# EAGLE board OpticalBoardRev1 (EAGLE 8.2.1), part 1 of 2
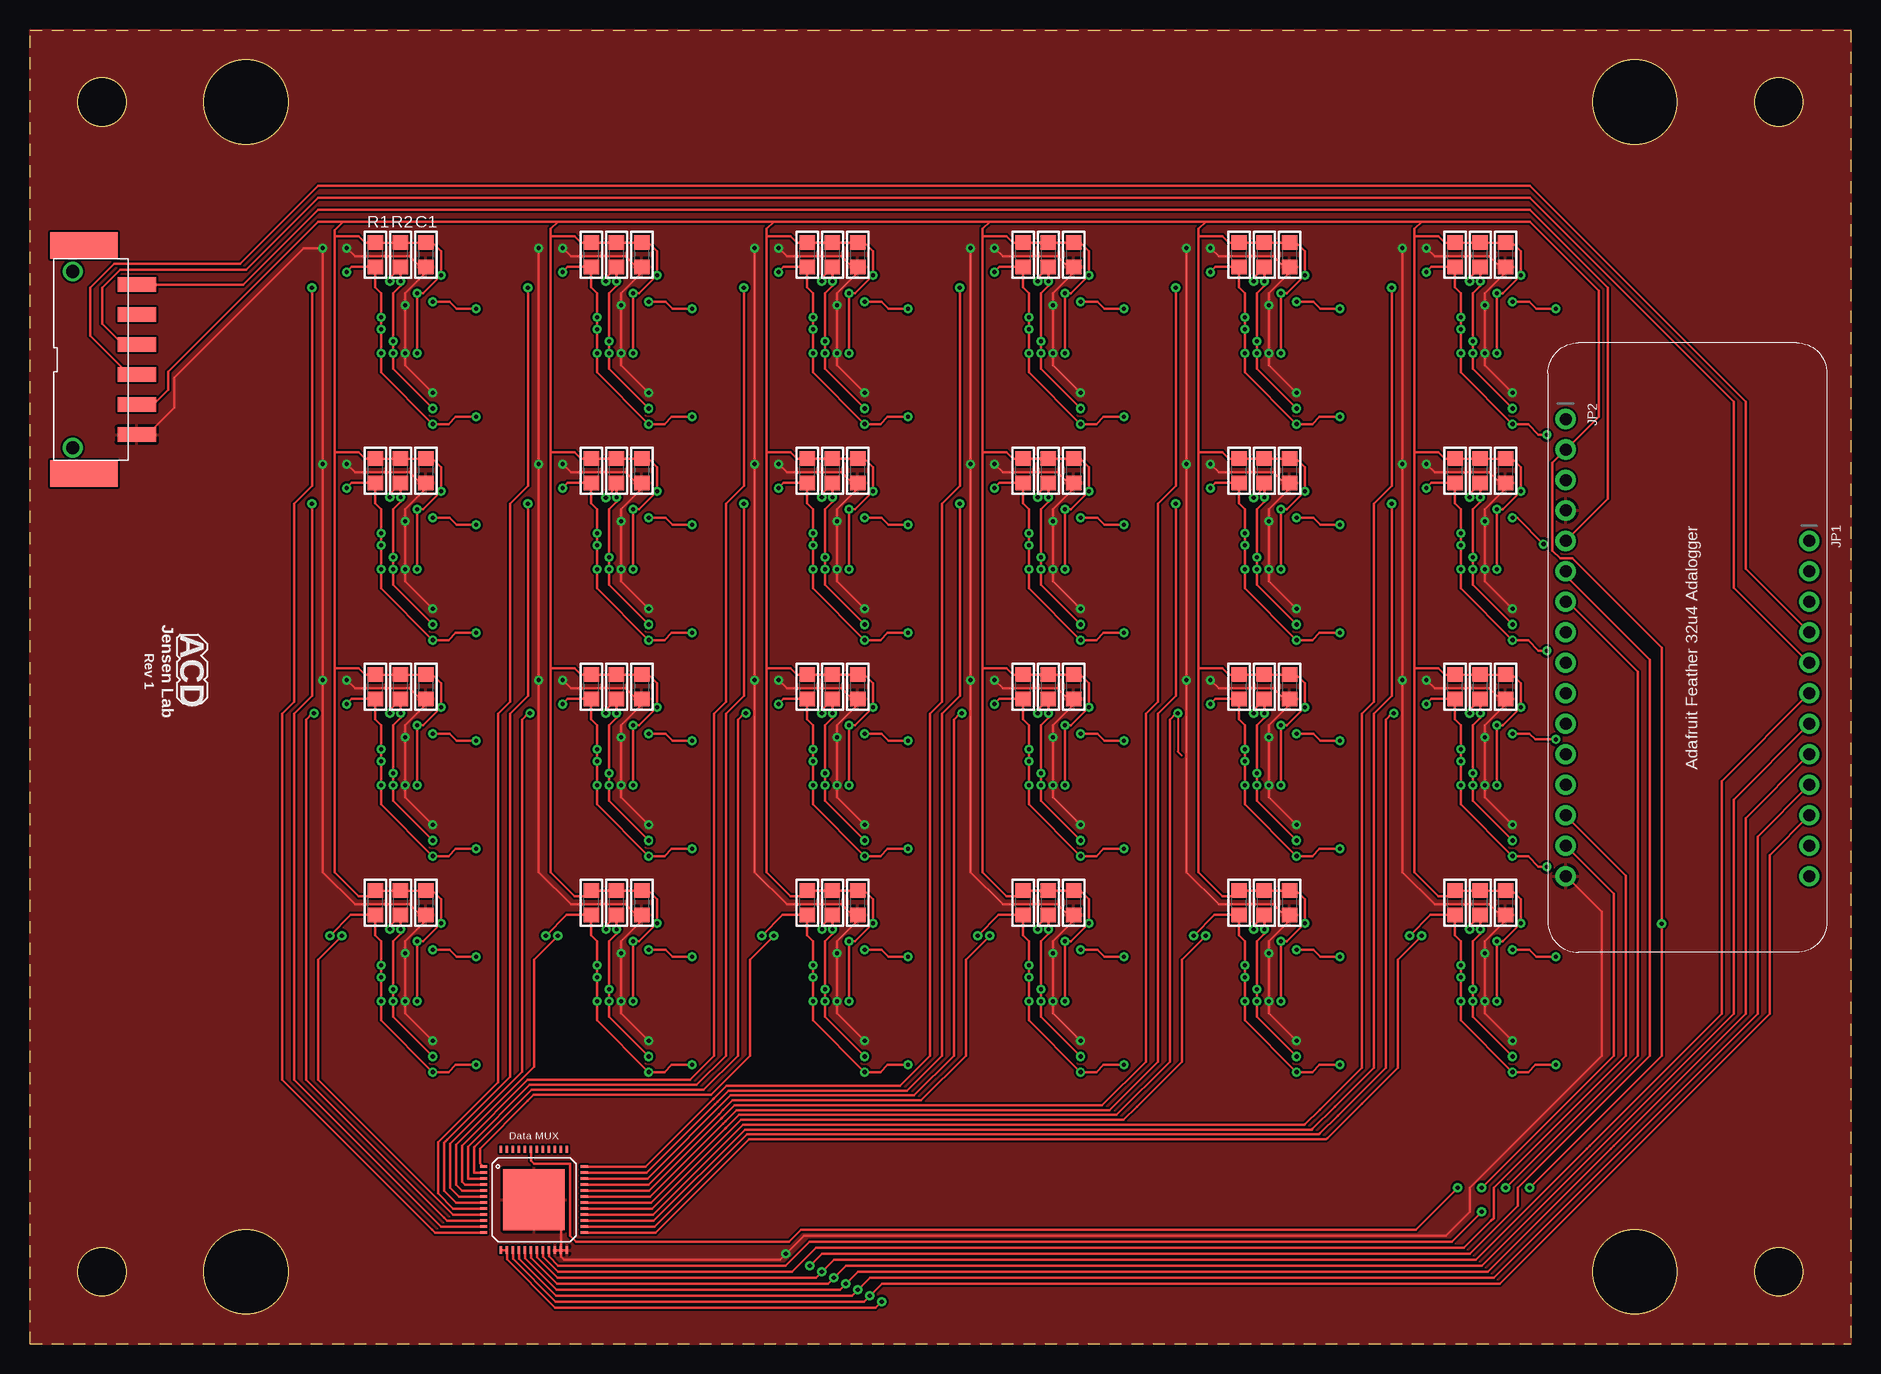
[diagram p2: board, top side]
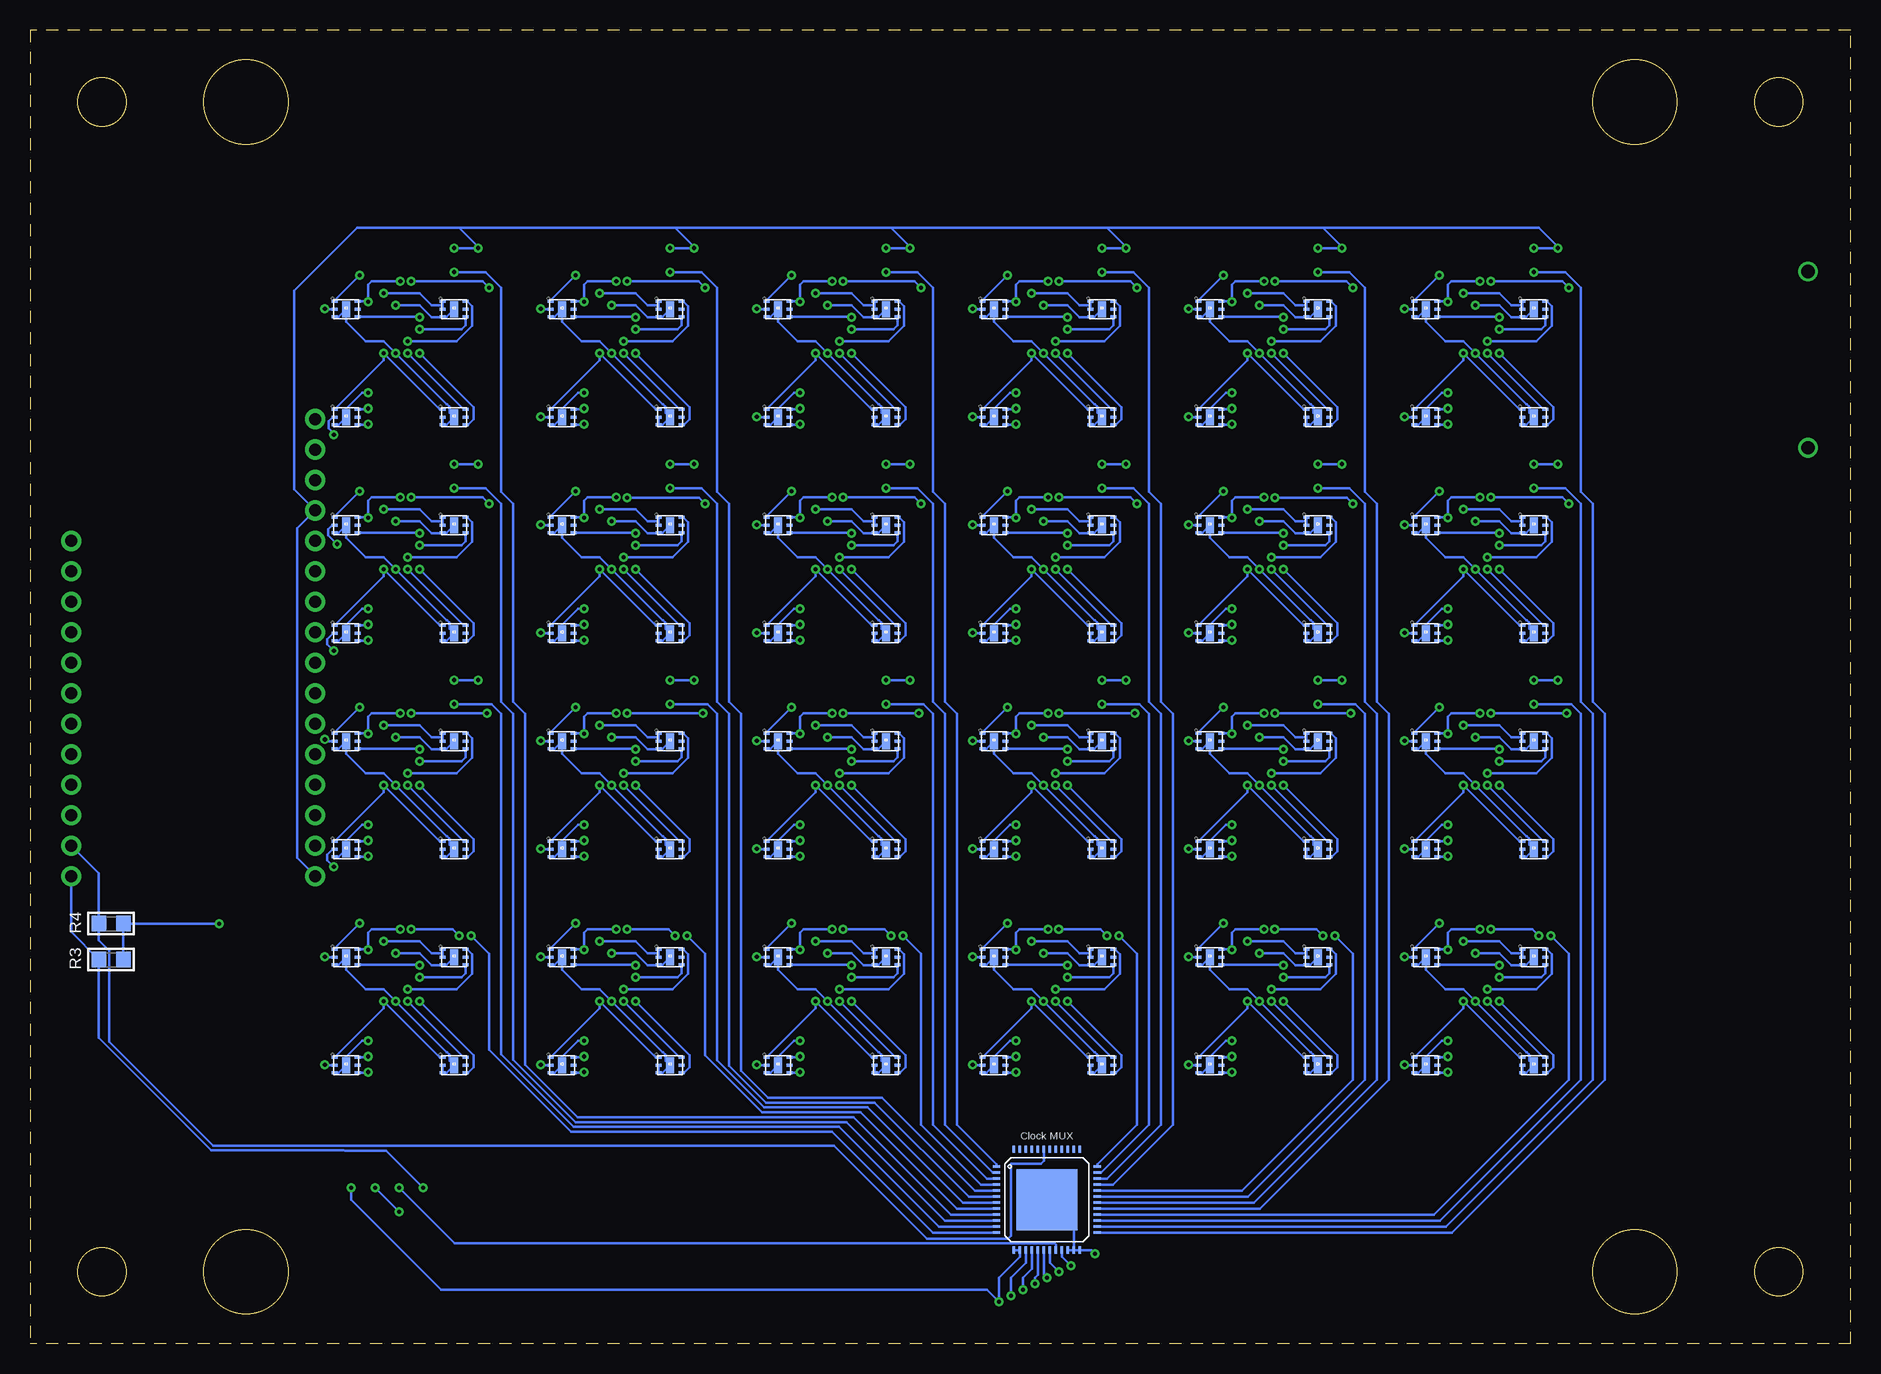
[diagram p3: board, bottom side, seen from below]

Size 151.76 x 109.47 mm. Coordinates in mm from the lower left corner, seen from the top.
Outline: 0,109.47 151.76,109.47 151.76,0 0,0 0,109.47
Outline: circle at 6,6 radius 2
Outline: circle at 145.76,6 radius 2
Outline: circle at 145.76,103.47 radius 2
Outline: circle at 6,103.47 radius 2
Outline: circle at 18,6 radius 3.5
Outline: circle at 18,103.47 radius 3.5
Outline: circle at 133.76,6 radius 3.5
Outline: circle at 133.76,103.47 radius 3.5
Copper layers (1*16): Top 0.035mm / dielectric 1.5mm / Bottom 0.035mm
Design rules "default *": minimum track width 6mil, minimum drill 0.35mm, track to track 7mil, track to pad 6mil, pad to pad 6mil, via to via 6mil, smd to smd 6mil, copper to edge 0mil, drill to drill 6mil, minimum pad ring 10mil, minimum via ring 8mil, stop-mask expansion 4mil, vias tented up to drill 0mil, thermal gap 10mil
Holes 4 mm at 6,6 145.76,6 6,103.47 145.76,103.47
Holes 7 mm at 18,103.47 133.76,103.47 18,6 133.76,6

## Footprints (pad centres in the part's own frame; a part is rotated, then mirrored left to right if it is on the bottom)
1X12_ROUND = drill 1 pad 1.676: 1 -13.97,0; 2 -11.43,0; 3 -8.89,0; 4 -6.35,0; 5 -3.81,0; 6 -1.27,0; 7 1.27,0; 8 3.81,0; 9 6.35,0; 10 8.89,0; 11 11.43,0; 12 13.97,0
1X16_ROUND = drill 1 pad 1.676: 1 -19.05,0; 2 -16.51,0; 3 -13.97,0; 4 -11.43,0; 5 -8.89,0; 6 -6.35,0; 7 -3.81,0; 8 -1.27,0; 9 1.27,0; 10 3.81,0; 11 6.35,0; 12 8.89,0; 13 11.43,0; 14 13.97,0; 15 16.51,0; 16 19.05,0
_0805 = smd 1.2 x 1.3: 1 -1.016,0; 2 1.016,0
2X2-OPT3002-2 = smd 0.5 x 0.25 bottom: 1 -0.95,0.56; 2 -0.95,-0.09; 3 -0.95,-0.74; 4 0.95,-0.74; 5 0.95,-0.09; 6 0.95,0.56; 8 -0.95,9.56; 9 -0.95,8.91; 10 -0.95,8.26; 11 0.95,8.26; 12 0.95,8.91; 13 0.95,9.56; 15 8.05,9.56; 16 8.05,8.91; 17 8.05,8.26; 18 9.95,8.26; 19 9.95,8.91; 20 9.95,9.56; 22 8.05,0.56; 23 8.05,-0.09; 24 8.05,-0.74; 25 9.95,-0.74; 26 9.95,-0.09; 27 9.95,0.56 | smd 0.65 x 1.35 bottom: 7 0,-0.09; 14 0,8.91; 21 9,8.91; 28 9,-0.09 | smd 1.3 x 1.2: 29 6.59,14.456; 30 6.59,12.424; 31 2.39,12.424; 32 2.39,14.456; 33 4.49,12.424; 34 4.49,14.456
CONNECTOR_6PIN = smd 1.2 x 3.2: 1 -6.25,4.4; 2 -3.75,4.4; 3 -1.25,4.4; 4 1.25,4.4; 5 3.75,4.4; 6 6.25,4.4 | drill 1.1: 7 -7.35,-0.95; 8 7.35,-0.95 | smd 2.2 x 5.6: LMOUNT -9.5,0; RMOUNT 9.5,0
32MUX = smd 0.6 x 0.22: 1 -4.2,2.75; 2 -4.2,2.25; 3 -4.2,1.75; 4 -4.2,1.25; 5 -4.2,0.75; 6 -4.2,0.25; 7 -4.2,-0.25; 8 -4.2,-0.75; 9 -4.2,-1.25; 10 -4.2,-1.75; 11 -4.2,-2.25; 12 -4.2,-2.75; 25 4.2,-2.75; 26 4.2,-2.25; 27 4.2,-1.75; 28 4.2,-1.25; 29 4.2,-0.75; 30 4.2,-0.25; 31 4.2,0.25; 32 4.2,0.75; 33 4.2,1.25; 34 4.2,1.75; 35 4.2,2.25; 36 4.2,2.75 | smd 0.22 x 0.6: 13 -2.75,-4.2; 14 -2.25,-4.2; 15 -1.75,-4.2; 16 -1.25,-4.2; 17 -0.75,-4.2; 18 -0.25,-4.2; 19 0.25,-4.2; 20 0.75,-4.2; 21 1.25,-4.2; 22 1.75,-4.2; 23 2.25,-4.2; 24 2.75,-4.2; 37 2.75,4.2; 38 2.25,4.2; 39 1.75,4.2; 40 1.25,4.2; 41 0.75,4.2; 42 0.25,4.2; 43 -0.25,4.2; 44 -0.75,4.2; 45 -1.25,4.2; 46 -1.75,4.2; 47 -2.25,4.2; 48 -2.75,4.2 | smd 5.1 x 5.1: 49 0,0
32MUX_BOT = smd 0.6 x 0.22 bottom: 1 4.2,2.75; 2 4.2,2.25; 3 4.2,1.75; 4 4.2,1.25; 5 4.2,0.75; 6 4.2,0.25; 7 4.2,-0.25; 8 4.2,-0.75; 9 4.2,-1.25; 10 4.2,-1.75; 11 4.2,-2.25; 12 4.2,-2.75; 25 -4.2,-2.75; 26 -4.2,-2.25; 27 -4.2,-1.75; 28 -4.2,-1.25; 29 -4.2,-0.75; 30 -4.2,-0.25; 31 -4.2,0.25; 32 -4.2,0.75; 33 -4.2,1.25; 34 -4.2,1.75; 35 -4.2,2.25; 36 -4.2,2.75 | smd 0.22 x 0.6 bottom: 13 2.75,-4.2; 14 2.25,-4.2; 15 1.75,-4.2; 16 1.25,-4.2; 17 0.75,-4.2; 18 0.25,-4.2; 19 -0.25,-4.2; 20 -0.75,-4.2; 21 -1.25,-4.2; 22 -1.75,-4.2; 23 -2.25,-4.2; 24 -2.75,-4.2; 37 -2.75,4.2; 38 -2.25,4.2; 39 -1.75,4.2; 40 -1.25,4.2; 41 -0.75,4.2; 42 -0.25,4.2; 43 0.25,4.2; 44 0.75,4.2; 45 1.25,4.2; 46 1.75,4.2; 47 2.25,4.2; 48 2.75,4.2 | smd 5.1 x 5.1 bottom: 49 0,0

## Placement (x,y rotation side)
JP1  [1X12_ROUND]  148.32,52.92 270 top
JP2  [1X16_ROUND]  128,58 270 top
R1  10K  [_0805]  145,35 0 bottom
R2  10K  [_0805]  145,32 0 bottom
U$1  2X2-OPT30022  [2X2-OPT3002-2]  26.4,23.3 0 top
U$2  2X2-OPT30022  [2X2-OPT3002-2]  26.4,41.3 0 top
U$3  2X2-OPT30022  [2X2-OPT3002-2]  26.4,59.3 0 top
U$4  2X2-OPT30022  [2X2-OPT3002-2]  26.4,77.3 0 top
U$5  2X2-OPT30022  [2X2-OPT3002-2]  44.4,23.3 0 top
U$6  2X2-OPT30022  [2X2-OPT3002-2]  44.4,41.3 0 top
U$7  2X2-OPT30022  [2X2-OPT3002-2]  44.4,59.3 0 top
U$8  2X2-OPT30022  [2X2-OPT3002-2]  44.4,77.3 0 top
U$9  2X2-OPT30022  [2X2-OPT3002-2]  62.4,23.3 0 top
U$10  2X2-OPT30022  [2X2-OPT3002-2]  62.4,41.3 0 top
U$11  2X2-OPT30022  [2X2-OPT3002-2]  62.4,59.3 0 top
U$12  2X2-OPT30022  [2X2-OPT3002-2]  62.4,77.3 0 top
U$13  2X2-OPT30022  [2X2-OPT3002-2]  80.4,23.3 0 top
U$14  2X2-OPT30022  [2X2-OPT3002-2]  80.4,41.3 0 top
U$15  2X2-OPT30022  [2X2-OPT3002-2]  80.4,59.3 0 top
U$16  2X2-OPT30022  [2X2-OPT3002-2]  80.4,77.3 0 top
U$17  2X2-OPT30022  [2X2-OPT3002-2]  98.4,23.3 0 top
U$18  2X2-OPT30022  [2X2-OPT3002-2]  98.4,41.3 0 top
U$19  2X2-OPT30022  [2X2-OPT3002-2]  98.4,59.3 0 top
U$20  2X2-OPT30022  [2X2-OPT3002-2]  98.4,77.3 0 top
U$21  2X2-OPT30022  [2X2-OPT3002-2]  116.4,23.3 0 top
U$22  2X2-OPT30022  [2X2-OPT3002-2]  116.4,41.3 0 top
U$23  2X2-OPT30022  [2X2-OPT3002-2]  116.4,59.3 0 top
U$24  2X2-OPT30022  [2X2-OPT3002-2]  116.4,77.3 0 top
U$25  CONNECTOR_6PIN  [CONNECTOR_6PIN]  4.5,82 270 top
U$26  32MUXTOP  [32MUX]  42,12 0 top
U$27  32MUXBOT  [32MUX_BOT]  67,12 0 top

## Tracks (layer width: path | path; a pad name or v marks a point on that pad's centre or on a via)
A0  (via drill 0.35)
  Top 0.203: U$26.15 40.25,7.06 43.81,3.5 69.5,3.5 v70,4 71,5 122.5,5 145,27.5 145,40.71 JP1.10
  Bottom 0.203: U$27.15 68.75,6.75 70,5.5 v70,4
A1  (via drill 0.35)
  Top 0.203: U$26.16 40.75,7.09 43.84,4 68.5,4 v69,4.5 70,5.5 122,5.5 144,27.5 144,42.25 JP1.9
  Bottom 0.203: U$27.16 68.25,6.25 69,5.5 v69,4.5
A2  (via drill 0.35)
  Top 0.203: U$26.17 41.25,7.13 43.88,4.5 67.5,4.5 v68,5 69,6 121.5,6 131.75,16.25 132,16.5 143,27.5 143,43.79 JP1.8
  Bottom 0.203: U$27.17 67.75,5.75 68,5.5 v68,5
A3  (via drill 0.35)
  Top 0.203: U$26.18 41.75,7.17 43.92,5 66.5,5 v67,5.5 68,6.5 121,6.5 142,27.5 142,45.33 JP1.7
  Bottom 0.203: U$27.18 67.25,5.75 v67,5.5
A4  (via drill 0.35)
  Top 0.203: U$26.19 42.25,7.21 43.96,5.5 65.5,5.5 v66,6 67,7 120.5,7 129.75,16.25 130,16.5 141,27.5 141,46.87 JP1.6
  Bottom 0.203: U$27.19 66.75,6.75 v66,6
CS1
  Top 0.203: U$26.20 42.75,7.25 44,6 63.5,6 65.5,8 119.54,8 121.77,10.23 122,10.46 122,13 133,24 133,39 128,44 JP2.14
CS2  (via drill 0.35)
  Top 0.203: JP2.15 132,37.5 132,24 v121,13
  Bottom 0.203: U$27.20 66.25,8.25 66.38,8.38 116.38,8.38 v121,13
GND  (via drill 0.35)
  Top 0.203: v33.58,25.23 31.28,27.53 v31.28,28.53 v31.28,32.53 31.28,33.53 32.99,35.24 U$1.30 32.53,35.72 31.66,36.6 27.1,36.6 24.4,39.3 v24.4,55.3 v24.4,73.3 v24.4,91.3 22.8,91.3 12,80.5 12,78 9.75,75.75 U$25.6 | v33.58,79.23 31.28,81.53 v31.28,82.53 v31.28,86.53 31.28,87.53 32.99,89.24 U$4.30 32.53,89.72 31.66,90.6 27.1,90.6 v26.4,91.3 | v33.58,61.23 31.28,63.53 v31.28,64.53 v31.28,68.53 31.28,69.53 32.99,71.24 U$3.30 32.53,71.72 31.66,72.6 27.1,72.6 v26.4,73.3 | v33.58,43.23 31.28,45.53 v31.28,46.53 v31.28,50.53 31.28,51.53 32.99,53.24 U$2.30 32.53,53.72 31.66,54.6 27.1,54.6 v26.4,55.3 | v51.58,25.23 49.28,27.53 v49.28,28.53 v49.28,32.53 49.28,33.53 50.99,35.24 U$5.30 50.53,35.72 49.66,36.6 45.1,36.6 42.4,39.3 v42.4,55.3 v42.4,73.3 v42.4,91.3 | v51.58,79.23 49.28,81.53 v49.28,82.53 v49.28,86.53 49.28,87.53 50.99,89.24 U$8.30 50.53,89.72 49.66,90.6 45.1,90.6 v44.4,91.3 | v51.58,61.23 49.28,63.53 v49.28,64.53 v49.28,68.53 49.28,69.53 50.99,71.24 U$7.30 50.53,71.72 49.66,72.6 45.1,72.6 v44.4,73.3 | v51.58,43.23 49.28,45.53 v49.28,46.53 v49.28,50.53 49.28,51.53 50.99,53.24 U$6.30 50.53,53.72 49.66,54.6 45.1,54.6 v44.4,55.3 | v69.58,25.23 67.28,27.53 v67.28,28.53 v67.28,32.53 67.28,33.53 68.99,35.24 U$9.30 68.53,35.72 67.66,36.6 63.1,36.6 60.4,39.3 v60.4,55.3 v60.4,73.3 v60.4,91.3 | v69.58,79.23 67.28,81.53 v67.28,82.53 v67.28,86.53 67.28,87.53 68.99,89.24 U$12.30 68.53,89.72 67.66,90.6 63.1,90.6 v62.4,91.3 | v69.58,61.23 67.28,63.53 v67.28,64.53 v67.28,68.53 67.28,69.53 68.99,71.24 U$11.30 68.53,71.72 67.66,72.6 63.1,72.6 v62.4,73.3
  Top 0.203: v69.58,43.23 67.28,45.53 v67.28,46.53 v67.28,50.53 67.28,51.53 68.99,53.24 U$10.30 68.53,53.72 67.66,54.6 63.1,54.6 v62.4,55.3 | v87.58,25.23 85.28,27.53 v85.28,28.53 v85.28,32.53 85.28,33.53 86.99,35.24 U$13.30 86.53,35.72 85.66,36.6 81.1,36.6 78.4,39.3 v78.4,55.3 v78.4,73.3 v78.4,91.3 | v87.58,79.23 85.28,81.53 v85.28,82.53 v85.28,86.53 85.28,87.53 86.99,89.24 U$16.30 86.53,89.72 85.66,90.6 81.1,90.6 v80.4,91.3 | v87.58,61.23 85.28,63.53 v85.28,64.53 v85.28,68.53 85.28,69.53 86.99,71.24 U$15.30 86.53,71.72 85.66,72.6 81.1,72.6 v80.4,73.3 | v87.58,43.23 85.28,45.53 v85.28,46.53 v85.28,50.53 85.28,51.53 86.99,53.24 U$14.30 86.53,53.72 85.66,54.6 81.1,54.6 v80.4,55.3 | v105.58,25.23 103.28,27.53 v103.28,28.53 v103.28,32.53 103.28,33.53 104.99,35.24 U$17.30 104.53,35.72 103.66,36.6 99.1,36.6 96.4,39.3 v96.4,55.3 v96.4,73.3 v96.4,91.3 | v105.58,79.23 103.28,81.53 v103.28,82.53 v103.28,86.53 103.28,87.53 104.99,89.24 U$20.30 104.53,89.72 103.66,90.6 99.1,90.6 v98.4,91.3 | v105.58,61.23 103.28,63.53 v103.28,64.53 v103.28,68.53 103.28,69.53 104.99,71.24 U$19.30 104.53,71.72 103.66,72.6 99.1,72.6 v98.4,73.3 | v105.58,43.23 103.28,45.53 v103.28,46.53 v103.28,50.53 103.28,51.53 104.99,53.24 U$18.30 104.53,53.72 103.66,54.6 99.1,54.6 v98.4,55.3 | v123.58,25.23 121.28,27.53 v121.28,28.53 v121.28,32.53 121.28,33.53 122.99,35.24 U$21.30 122.53,35.72 121.66,36.6 117.1,36.6 114.4,39.3 v114.4,55.3 v114.4,73.3 v114.4,91.3 | v123.58,79.23 121.28,81.53 v121.28,82.53 v121.28,86.53 121.28,87.53 122.99,89.24 U$24.30 122.53,89.72 121.66,90.6 117.1,90.6 v116.4,91.3
  Top 0.203: v123.58,61.23 121.28,63.53 v121.28,64.53 v121.28,68.53 121.28,69.53 122.99,71.24 U$23.30 122.53,71.72 121.66,72.6 117.1,72.6 v116.4,73.3 | v123.58,43.23 121.28,45.53 v121.28,46.53 v121.28,50.53 121.28,51.53 122.99,53.24 U$22.30 122.53,53.72 121.66,54.6 117.1,54.6 v116.4,55.3 | U$26.23 44.25,7.25 44.5,7 62.5,7 v63,7.5 64.5,9 118,9 120,11 120,13 131,24 131,36 128.05,38.95 JP2.16 | U$26.23 U$26.24 | U$26.23 U$26.22 | U$26.49 44.25,9.75 U$26.23
  Bottom 0.203: U$1.18 36.05,31.56 U$1.21 35.4,31.15 33.78,29.53 32.28,29.53 v31.28,28.53 27.01,24.26 26.98,24.26 26.82,24.1 26.82,24.07 26.78,24.03 26.78,23.59 U$1.7 27.05,22.56 U$1.4 U$1.5 | U$1.25 36.05,22.56 U$1.28 35.4,23.91 34.08,25.23 v33.58,25.23 | U$1.14 27.05,31.56 U$1.11 27.38,31.53 28.28,31.53 29.28,32.53 v31.28,32.53 | U$4.18 36.05,85.56 U$4.21 35.4,85.15 33.78,83.53 32.28,83.53 v31.28,82.53 27.01,78.26 26.98,78.26 26.82,78.1 26.82,78.07 26.78,78.03 26.78,77.59 U$4.7 27.05,76.56 U$4.4 U$4.5 | U$4.25 36.05,76.56 U$4.28 35.4,77.91 34.08,79.23 v33.58,79.23 | U$4.14 27.05,85.56 U$4.11 27.38,85.53 28.28,85.53 29.28,86.53 v31.28,86.53 | U$3.18 36.05,67.56 U$3.21 35.4,67.15 33.78,65.53 32.28,65.53 v31.28,64.53 27.01,60.26 26.98,60.26 26.82,60.1 26.82,60.07 26.78,60.03 26.78,59.59 U$3.7 27.05,58.56 U$3.4 U$3.5 | U$3.25 36.05,58.56 U$3.28 35.4,59.91 34.08,61.23 v33.58,61.23 | U$3.14 27.05,67.56 U$3.11 27.38,67.53 28.28,67.53 29.28,68.53 v31.28,68.53 | U$2.18 36.05,49.56 U$2.21 35.4,49.15 33.78,47.53 32.28,47.53 v31.28,46.53 27.01,42.26 26.98,42.26 26.82,42.1 26.82,42.07 26.78,42.03 26.78,41.59 U$2.7 27.05,40.56 U$2.4 U$2.5 | U$2.25 36.05,40.56 U$2.28 35.4,41.91 34.08,43.23 v33.58,43.23 | U$2.14 27.05,49.56 U$2.11 27.38,49.53 28.28,49.53 29.28,50.53 v31.28,50.53 | v26.4,55.3 v24.4,55.3 | v26.4,73.3 v24.4,73.3 | v26.4,91.3 v24.4,91.3 24.4,91.4 26,93 44,93 | U$5.18 54.05,31.56 U$5.21 53.4,31.15 51.78,29.53 50.28,29.53 v49.28,28.53 45.01,24.26 44.98,24.26 44.82,24.1 44.82,24.07 44.78,24.03 44.78,23.59 U$5.7 45.05,22.56 U$5.4 U$5.5 | U$5.25 54.05,22.56 U$5.28 53.4,23.91 52.08,25.23 v51.58,25.23
  Bottom 0.203: U$5.14 45.05,31.56 U$5.11 45.38,31.53 46.28,31.53 47.28,32.53 v49.28,32.53 | U$8.18 54.05,85.56 U$8.21 53.4,85.15 51.78,83.53 50.28,83.53 v49.28,82.53 45.01,78.26 44.98,78.26 44.82,78.1 44.82,78.07 44.78,78.03 44.78,77.59 U$8.7 45.05,76.56 U$8.4 U$8.5 | U$8.25 54.05,76.56 U$8.28 53.4,77.91 52.08,79.23 v51.58,79.23 | U$8.14 45.05,85.56 U$8.11 45.38,85.53 46.28,85.53 47.28,86.53 v49.28,86.53 | U$7.18 54.05,67.56 U$7.21 53.4,67.15 51.78,65.53 50.28,65.53 v49.28,64.53 45.01,60.26 44.98,60.26 44.82,60.1 44.82,60.07 44.78,60.03 44.78,59.59 U$7.7 45.05,58.56 U$7.4 U$7.5 | U$7.25 54.05,58.56 U$7.28 53.4,59.91 52.08,61.23 v51.58,61.23 | U$7.14 45.05,67.56 U$7.11 45.38,67.53 46.28,67.53 47.28,68.53 v49.28,68.53 | U$6.18 54.05,49.56 U$6.21 53.4,49.15 51.78,47.53 50.28,47.53 v49.28,46.53 45.01,42.26 44.98,42.26 44.82,42.1 44.82,42.07 44.78,42.03 44.78,41.59 U$6.7 45.05,40.56 U$6.4 U$6.5 | U$6.25 54.05,40.56 U$6.28 53.4,41.91 52.08,43.23 v51.58,43.23 | U$6.14 45.05,49.56 U$6.11 45.38,49.53 46.28,49.53 47.28,50.53 v49.28,50.53 | v44.4,55.3 v42.4,55.3 | v44.4,73.3 v42.4,73.3 | v44.4,91.3 v42.4,91.3 42.4,91.4 44,93 | U$9.18 72.05,31.56 U$9.21 71.4,31.15 69.78,29.53 68.28,29.53 v67.28,28.53 63.01,24.26 62.98,24.26 62.82,24.1 62.82,24.07 62.78,24.03 62.78,23.59 U$9.7 63.05,22.56 U$9.4 U$9.5 | U$9.25 72.05,22.56 U$9.28 71.4,23.91 70.08,25.23 v69.58,25.23 | U$9.14 63.05,31.56 U$9.11 63.38,31.53 64.28,31.53 65.28,32.53 v67.28,32.53 | U$12.18 72.05,85.56 U$12.21 71.4,85.15 69.78,83.53 68.28,83.53 v67.28,82.53 63.01,78.26 62.98,78.26 62.82,78.1 62.82,78.07 62.78,78.03 62.78,77.59 U$12.7 63.05,76.56 U$12.4 U$12.5
  Bottom 0.203: U$12.25 72.05,76.56 U$12.28 71.4,77.91 70.08,79.23 v69.58,79.23 | U$12.14 63.05,85.56 U$12.11 63.38,85.53 64.28,85.53 65.28,86.53 v67.28,86.53 | U$11.18 72.05,67.56 U$11.21 71.4,67.15 69.78,65.53 68.28,65.53 v67.28,64.53 63.01,60.26 62.98,60.26 62.82,60.1 62.82,60.07 62.78,60.03 62.78,59.59 U$11.7 63.05,58.56 U$11.4 U$11.5 | U$11.25 72.05,58.56 U$11.28 71.4,59.91 70.08,61.23 v69.58,61.23 | U$11.14 63.05,67.56 U$11.11 63.38,67.53 64.28,67.53 65.28,68.53 v67.28,68.53 | U$10.18 72.05,49.56 U$10.21 71.4,49.15 69.78,47.53 68.28,47.53 v67.28,46.53 63.01,42.26 62.98,42.26 62.82,42.1 62.82,42.07 62.78,42.03 62.78,41.59 U$10.7 63.05,40.56 U$10.4 U$10.5 | U$10.25 72.05,40.56 U$10.28 71.4,41.91 70.08,43.23 v69.58,43.23 | U$10.14 63.05,49.56 U$10.11 63.38,49.53 64.28,49.53 65.28,50.53 v67.28,50.53 | v62.4,55.3 v60.4,55.3 | v62.4,73.3 v60.4,73.3 | v62.4,91.3 v60.4,91.3 60.4,91.4 62,93 | U$13.18 90.05,31.56 U$13.21 89.4,31.15 87.78,29.53 86.28,29.53 v85.28,28.53 81.01,24.26 80.98,24.26 80.82,24.1 80.82,24.07 80.78,24.03 80.78,23.59 U$13.7 81.05,22.56 U$13.4 U$13.5 | U$13.25 90.05,22.56 U$13.28 89.4,23.91 88.08,25.23 v87.58,25.23 | U$13.14 81.05,31.56 U$13.11 81.38,31.53 82.28,31.53 83.28,32.53 v85.28,32.53 | U$16.18 90.05,85.56 U$16.21 89.4,85.15 87.78,83.53 86.28,83.53 v85.28,82.53 81.01,78.26 80.98,78.26 80.82,78.1 80.82,78.07 80.78,78.03 80.78,77.59 U$16.7 81.05,76.56 U$16.4 U$16.5 | U$16.25 90.05,76.56 U$16.28 89.4,77.91 88.08,79.23 v87.58,79.23 | U$16.14 81.05,85.56 U$16.11 81.38,85.53 82.28,85.53 83.28,86.53 v85.28,86.53 | U$15.18 90.05,67.56 U$15.21 89.4,67.15 87.78,65.53 86.28,65.53 v85.28,64.53 81.01,60.26 80.98,60.26 80.82,60.1 80.82,60.07 80.78,60.03 80.78,59.59 U$15.7 81.05,58.56 U$15.4 U$15.5
  Bottom 0.203: U$15.25 90.05,58.56 U$15.28 89.4,59.91 88.08,61.23 v87.58,61.23 | U$15.14 81.05,67.56 U$15.11 81.38,67.53 82.28,67.53 83.28,68.53 v85.28,68.53 | U$14.18 90.05,49.56 U$14.21 89.4,49.15 87.78,47.53 86.28,47.53 v85.28,46.53 81.01,42.26 80.98,42.26 80.82,42.1 80.82,42.07 80.78,42.03 80.78,41.59 U$14.7 81.05,40.56 U$14.4 U$14.5 | U$14.25 90.05,40.56 U$14.28 89.4,41.91 88.08,43.23 v87.58,43.23 | U$14.14 81.05,49.56 U$14.11 81.38,49.53 82.28,49.53 83.28,50.53 v85.28,50.53 | v80.4,55.3 v78.4,55.3 | v80.4,73.3 v78.4,73.3 | v80.4,91.3 v78.4,91.3 78.4,91.4 80,93 | U$17.18 108.05,31.56 U$17.21 107.4,31.15 105.78,29.53 104.28,29.53 v103.28,28.53 99.01,24.26 98.98,24.26 98.82,24.1 98.82,24.07 98.78,24.03 98.78,23.59 U$17.7 99.05,22.56 U$17.4 U$17.5 | U$17.25 108.05,22.56 U$17.28 107.4,23.91 106.08,25.23 v105.58,25.23 | U$17.14 99.05,31.56 U$17.11 99.38,31.53 100.28,31.53 101.28,32.53 v103.28,32.53 | U$20.18 108.05,85.56 U$20.21 107.4,85.15 105.78,83.53 104.28,83.53 v103.28,82.53 99.01,78.26 98.98,78.26 98.82,78.1 98.82,78.07 98.78,78.03 98.78,77.59 U$20.7 99.05,76.56 U$20.4 U$20.5 | U$20.25 108.05,76.56 U$20.28 107.4,77.91 106.08,79.23 v105.58,79.23 | U$20.14 99.05,85.56 U$20.11 99.38,85.53 100.28,85.53 101.28,86.53 v103.28,86.53 | U$19.18 108.05,67.56 U$19.21 107.4,67.15 105.78,65.53 104.28,65.53 v103.28,64.53 99.01,60.26 98.98,60.26 98.82,60.1 98.82,60.07 98.78,60.03 98.78,59.59 U$19.7 99.05,58.56 U$19.4 U$19.5 | U$19.25 108.05,58.56 U$19.28 107.4,59.91 106.08,61.23 v105.58,61.23 | U$19.14 99.05,67.56 U$19.11 99.38,67.53 100.28,67.53 101.28,68.53 v103.28,68.53
  Bottom 0.203: U$18.18 108.05,49.56 U$18.21 107.4,49.15 105.78,47.53 104.28,47.53 v103.28,46.53 99.01,42.26 98.98,42.26 98.82,42.1 98.82,42.07 98.78,42.03 98.78,41.59 U$18.7 99.05,40.56 U$18.4 U$18.5 | U$18.25 108.05,40.56 U$18.28 107.4,41.91 106.08,43.23 v105.58,43.23 | U$18.14 99.05,49.56 U$18.11 99.38,49.53 100.28,49.53 101.28,50.53 v103.28,50.53 | v98.4,55.3 v96.4,55.3 | v98.4,73.3 v96.4,73.3 | v98.4,91.3 v96.4,91.3 96.4,91.4 98,93 | U$21.18 126.05,31.56 U$21.21 125.4,31.15 123.78,29.53 122.28,29.53 v121.28,28.53 117.01,24.26 116.98,24.26 116.82,24.1 116.82,24.07 116.78,24.03 116.78,23.59 U$21.7 117.05,22.56 U$21.4 U$21.5 | U$21.25 126.05,22.56 U$21.28 125.4,23.91 124.08,25.23 v123.58,25.23 | U$21.14 117.05,31.56 U$21.11 117.38,31.53 118.28,31.53 119.28,32.53 v121.28,32.53 | U$24.18 126.05,85.56 U$24.21 125.4,85.15 123.78,83.53 122.28,83.53 v121.28,82.53 117.01,78.26 116.98,78.26 116.82,78.1 116.82,78.07 116.78,78.03 116.78,77.59 U$24.7 117.05,76.56 U$24.4 U$24.5 | U$24.25 126.05,76.56 U$24.28 125.4,77.91 124.08,79.23 v123.58,79.23 | U$24.14 117.05,85.56 U$24.11 117.38,85.53 118.28,85.53 119.28,86.53 v121.28,86.53 | U$23.18 126.05,67.56 U$23.21 125.4,67.15 123.78,65.53 122.28,65.53 v121.28,64.53 117.01,60.26 116.98,60.26 116.82,60.1 116.82,60.07 116.78,60.03 116.78,59.59 U$23.7 117.05,58.56 U$23.4 U$23.5 | U$23.25 126.05,58.56 U$23.28 125.4,59.91 124.08,61.23 v123.58,61.23 | U$23.14 117.05,67.56 U$23.11 117.38,67.53 118.28,67.53 119.28,68.53 v121.28,68.53 | U$22.18 126.05,49.56 U$22.21 125.4,49.15 123.78,47.53 122.28,47.53 v121.28,46.53 117.01,42.26 116.98,42.26 116.82,42.1 116.82,42.07 116.78,42.03 116.78,41.59 U$22.7 117.05,40.56 U$22.4 U$22.5
  Bottom 0.203: U$22.25 126.05,40.56 U$22.28 125.4,41.91 124.08,43.23 v123.58,43.23 | U$22.14 117.05,49.56 U$22.11 117.38,49.53 118.28,49.53 119.28,50.53 v121.28,50.53 | v116.4,55.3 v114.4,55.3 | v116.4,73.3 v114.4,73.3 | v116.4,91.3 v114.4,91.3 114.4,91.4 116,93 | 62,93 44,93 | 80,93 62,93 | 98,93 80,93 | 116,93 98,93 | 116,93 124.5,93 129.75,87.75 129.75,71.18 JP2.4 129.5,67.93 129.5,40.5 128,39 JP2.16 | U$27.49 64.75,9.75 U$27.23 | U$27.23 U$27.24 63.3,7.8 v63,7.5 | U$27.23 U$27.22
  Bottom 0.254: 35.44,23.17 U$1.28 | 35.44,77.17 U$4.28 | 35.44,59.17 U$3.28 | 35.44,41.17 U$2.28 | 53.44,23.17 U$5.28 | 53.44,77.17 U$8.28 | 53.44,59.17 U$7.28 | 53.44,41.17 U$6.28 | 71.44,23.17 U$9.28 | 71.44,77.17 U$12.28 | 71.44,59.17 U$11.28 | 71.44,41.17 U$10.28 | 89.44,23.17 U$13.28 | 89.44,77.17 U$16.28 | 89.44,59.17 U$15.28 | 89.44,41.17 U$14.28 | 107.44,23.17 U$17.28 | 107.44,77.17 U$20.28 | 107.44,59.17 U$19.28 | 107.44,41.17 U$18.28 | 125.44,23.17 U$21.28 | 125.44,77.17 U$24.28 | 125.44,59.17 U$23.28 | 125.44,41.17 U$22.28
  pour Top: 0,0 151.76,0 151.76,109.47 0,109.47
LEDCLK
  Top 0.203: JP1.5 148.27,56.73 142,63 142,78.5 125,95.5 24,95.5 18,89.5 7.5,89.5 6,88 6,85 8,83 8.65,83 U$25.3 9.75,83.25
LEDDAT
  Top 0.203: 148.23,59.27 JP1.4 143,64.59 143,78.5 125,96.5 24,96.5 17.5,90 7,90 5,88 5,84 8,81 8.65,81 U$25.4 10.25,80.75
LEDLAT
  Top 0.203: JP2.5 131.5,70.39 131.5,88 125,94.5 24,94.5 17.75,88.25 U$25.1
SCL1  (via drill 0.35)
  Top 0.203: v37.18,23.23 35.48,23.23 34.88,22.63 v33.58,22.63 29.28,26.93 v29.28,28.53 v29.28,30.53 v29.28,31.53 29.28,33.54 28.79,34.03 U$1.31 26.72,35.72 v25,34
  Bottom 0.203: U$1.26 37.06,23.21 v37.18,23.23 | U$1.24 33.65,22.56 v33.58,22.63 | U$1.10 25.45,30.86 25.78,30.53 v29.28,30.53 | U$1.17 29.31,31.56 v29.28,31.53 | v29.28,28.53 24.78,24.03 24.78,23.03 25.25,22.56 U$1.3 | v25,34 23.5,32.5 23.5,22 34.75,10.75 U$27.28
SCL2  (via drill 0.35)
  Top 0.203: v37.18,41.23 35.48,41.23 34.88,40.63 v33.58,40.63 29.28,44.93 v29.28,46.53 v29.28,48.53 v29.28,49.53 29.28,51.54 28.79,52.03 U$2.31 26.82,53.72 v26.4,53.3
  Bottom 0.203: U$2.26 37.06,41.21 v37.18,41.23 | U$2.24 33.65,40.56 v33.58,40.63 | U$2.10 25.45,48.86 25.78,48.53 v29.28,48.53 | U$2.17 29.31,49.56 v29.28,49.53 | v29.28,46.53 24.78,42.03 24.78,41.03 25.25,40.56 U$2.3 | v26.4,53.3 23.3,53.3 22.5,52.5 22.5,22 34.25,10.25 U$27.27
SCL3  (via drill 0.35)
  Top 0.203: v37.18,59.23 35.48,59.23 34.88,58.63 v33.58,58.63 29.28,62.93 v29.28,64.53 v29.28,66.53 v29.28,67.53 29.28,69.54 28.79,70.03 U$3.31 26.82,71.72 v26.4,71.3
  Bottom 0.203: U$3.26 37.06,59.21 v37.18,59.23 | U$3.24 33.65,58.56 v33.58,58.63 | U$3.10 25.45,66.86 25.78,66.53 v29.28,66.53 | U$3.17 29.31,67.56 v29.28,67.53 | v29.28,64.53 24.78,60.03 24.78,59.03 25.25,58.56 U$3.3 | v26.4,71.3 23.8,71.3 22.5,70 22.5,53.5 21.5,52.5 21.5,22 33.75,9.75 U$27.26
SCL4  (via drill 0.35)
  Top 0.203: v37.18,77.23 35.48,77.23 34.88,76.63 v33.58,76.63 29.28,80.93 v29.28,82.53 v29.28,84.53 v29.28,85.53 29.28,87.54 28.79,88.03 U$4.31 26.82,89.72 v26.4,89.3
  Bottom 0.203: U$4.26 37.06,77.21 v37.18,77.23 | U$4.24 33.65,76.56 v33.58,76.63 | U$4.10 25.45,84.86 25.78,84.53 v29.28,84.53 | U$4.17 29.31,85.56 v29.28,85.53 | v29.28,82.53 24.78,78.03 24.78,77.03 25.25,76.56 U$4.3 | v26.4,89.3 23.8,89.3 22.5,88 22.5,71 21.5,70 21.5,53.5 20.5,52.5 20.5,22 33.25,9.25 U$27.25
SCL5  (via drill 0.35)
  Top 0.203: v55.18,23.23 53.48,23.23 52.88,22.63 v51.58,22.63 47.28,26.93 v47.28,28.53 v47.28,30.53 v47.28,31.53 47.28,33.54 46.79,34.03 U$5.31 44.72,35.72 v43,34
  Bottom 0.203: U$5.26 55.06,23.21 v55.18,23.23 | U$5.24 51.65,22.56 v51.58,22.63 | U$5.10 43.45,30.86 43.78,30.53 v47.28,30.53 | U$5.17 47.31,31.56 v47.28,31.53 | v47.28,28.53 42.78,24.03 42.78,23.03 43.25,22.56 U$5.3 | v43,34 41.5,32.5 41.5,22 50.75,12.75 U$27.32
SCL6  (via drill 0.35)
  Top 0.203: v44.4,53.3 44.82,53.72 U$6.31 46.79,52.03 47.28,51.54 v47.28,49.53 v47.28,48.53 v47.28,46.53 47.28,44.93 v51.58,40.63 52.88,40.63 53.48,41.23 v55.18,41.23
  Bottom 0.203: U$6.26 55.06,41.21 v55.18,41.23 | U$6.24 51.65,40.56 v51.58,40.63 | U$6.17 47.31,49.56 v47.28,49.53 | U$6.10 43.45,48.86 43.78,48.53 v47.28,48.53 | U$6.3 43.25,40.56 42.78,41.03 42.78,42.03 v47.28,46.53 | v44.4,53.3 41.3,53.3 40.5,52.5 40.5,22 50.25,12.25 U$27.31
SCL7  (via drill 0.35)
  Top 0.203: v55.18,59.23 53.48,59.23 52.88,58.63 v51.58,58.63 47.28,62.93 v47.28,64.53 v47.28,66.53 v47.28,67.53 47.28,69.54 46.79,70.03 U$7.31 44.82,71.72 v44.4,71.3
  Bottom 0.203: U$7.26 55.06,59.21 v55.18,59.23 | U$7.24 51.65,58.56 v51.58,58.63 | U$7.10 43.45,66.86 43.78,66.53 v47.28,66.53 | U$7.17 47.31,67.56 v47.28,67.53 | v47.28,64.53 42.78,60.03 42.78,59.03 43.25,58.56 U$7.3 | v44.4,71.3 41.8,71.3 40.5,70 40.5,53.5 39.5,52.5 39.5,22 49.75,11.75 U$27.30
SCL8  (via drill 0.35)
  Top 0.203: v55.18,77.23 53.48,77.23 52.88,76.63 v51.58,76.63 47.28,80.93 v47.28,82.53 v47.28,84.53 v47.28,85.53 47.28,87.54 46.79,88.03 U$8.31 44.82,89.72 v44.4,89.3
  Bottom 0.203: U$8.26 55.06,77.21 v55.18,77.23 | U$8.24 51.65,76.56 v51.58,76.63 | U$8.10 43.45,84.86 43.78,84.53 v47.28,84.53 | U$8.17 47.31,85.56 v47.28,85.53 | v47.28,82.53 42.78,78.03 42.78,77.03 43.25,76.56 U$8.3 | v44.4,89.3 41.8,89.3 40.5,88 40.5,71 39.5,70 39.5,53.5 38.5,52.5 38.5,22 49.25,11.25 U$27.29
SCL9  (via drill 0.35)
  Top 0.203: v73.18,23.23 71.48,23.23 70.88,22.63 v69.58,22.63 65.28,26.93 v65.28,28.53 v65.28,30.53 v65.28,31.53 65.28,33.54 64.79,34.03 U$9.31 62.72,35.72 v61,34
  Bottom 0.203: U$9.26 73.06,23.21 v73.18,23.23 | U$9.24 69.65,22.56 v69.58,22.63 | U$9.10 61.45,30.86 61.78,30.53 v65.28,30.53 | U$9.17 65.31,31.56 v65.28,31.53 | v65.28,28.53 60.78,24.03 60.78,23.03 61.25,22.56 U$9.3 | v61,34 59.5,32.5 59.5,18.25 62.8,14.95 U$27.36
SCL10  (via drill 0.35)
  Top 0.203: v73.18,41.23 71.48,41.23 70.88,40.63 v69.58,40.63 65.28,44.93 v65.28,46.53 v65.28,48.53 v65.28,49.53 65.28,51.54 64.79,52.03 U$10.31 62.82,53.72 v62.4,53.3
  Bottom 0.203: U$10.26 73.06,41.21 v73.18,41.23 | U$10.24 69.65,40.56 v69.58,40.63 | U$10.10 61.45,48.86 61.78,48.53 v65.28,48.53 | U$10.17 65.31,49.56 v65.28,49.53 | v65.28,46.53 60.78,42.03 60.78,41.03 61.25,40.56 U$10.3 | v62.4,53.3 59.3,53.3 58.5,52.5 58.5,18.25 62.5,14.25 U$27.35
SCL11  (via drill 0.35)
  Top 0.203: v73.18,59.23 71.48,59.23 70.88,58.63 v69.58,58.63 65.28,62.93 v65.28,64.53 v65.28,66.53 v65.28,67.53 65.28,69.54 64.79,70.03 U$11.31 62.82,71.72 v62.4,71.3
  Bottom 0.203: U$11.26 73.06,59.21 v73.18,59.23 | U$11.24 69.65,58.56 v69.58,58.63 | U$11.10 61.45,66.86 61.78,66.53 v65.28,66.53 | U$11.17 65.31,67.56 v65.28,67.53 | v65.28,64.53 60.78,60.03 60.78,59.03 61.25,58.56 U$11.3 | v62.4,71.3 59.8,71.3 58.5,70 58.5,53.5 57.5,52.5 57.5,18.25 62,13.75 U$27.34
SCL12  (via drill 0.35)
  Top 0.203: v73.18,77.23 71.48,77.23 70.88,76.63 v69.58,76.63 65.28,80.93 v65.28,82.53 v65.28,84.53 v65.28,85.53 65.28,87.54 64.79,88.03 U$12.31 62.82,89.72 v62.4,89.3
  Bottom 0.203: U$12.26 73.06,77.21 v73.18,77.23 | U$12.24 69.65,76.56 v69.58,76.63 | U$12.10 61.45,84.86 61.78,84.53 v65.28,84.53 | U$12.17 65.31,85.56 v65.28,85.53 | v65.28,82.53 60.78,78.03 60.78,77.03 61.25,76.56 U$12.3 | v62.4,89.3 59.8,89.3 58.5,88 58.5,71 57.5,70 57.5,53.5 56.5,52.5 56.5,18.25 61.5,13.25 U$27.33
SCL13  (via drill 0.35)
  Top 0.203: v91.18,23.23 89.48,23.23 88.88,22.63 v87.58,22.63 83.28,26.93 v83.28,28.53 v83.28,30.53 v83.28,31.53 83.28,33.54 82.79,34.03 U$13.31 80.72,35.72 v79,34
  Bottom 0.203: U$13.26 91.06,23.21 v91.18,23.23 | U$13.24 87.65,22.56 v87.58,22.63 | U$13.10 79.45,30.86 79.78,30.53 v83.28,30.53 | U$13.17 83.31,31.56 v83.28,31.53 | v83.28,28.53 78.78,24.03 78.78,23.03 79.25,22.56 U$13.3 | v79,34 77.5,32.5 77.5,18.25 72.5,13.25 U$27.4
SCL14  (via drill 0.35)
  Top 0.203: v91.18,41.23 89.48,41.23 88.88,40.63 v87.58,40.63 83.28,44.93 v83.28,46.53 v83.28,48.53 v83.28,49.53 83.28,51.54 82.79,52.03 U$14.31 80.82,53.72 v80.4,53.3
  Bottom 0.203: U$14.26 91.06,41.21 v91.18,41.23 | U$14.24 87.65,40.56 v87.58,40.63 | U$14.10 79.45,48.86 79.78,48.53 v83.28,48.53 | U$14.17 83.31,49.56 v83.28,49.53 | v83.28,46.53 78.78,42.03 78.78,41.03 79.25,40.56 U$14.3 | v80.4,53.3 77.3,53.3 76.5,52.5 76.5,18.25 72,13.75 U$27.3
SCL15  (via drill 0.35)
  Top 0.203: v91.18,59.23 89.48,59.23 88.88,58.63 v87.58,58.63 83.28,62.93 v83.28,64.53 v83.28,66.53 v83.28,67.53 83.28,69.54 82.79,70.03 U$15.31 80.82,71.72 v80.4,71.3
  Bottom 0.203: U$15.26 91.06,59.21 v91.18,59.23 | U$15.24 87.65,58.56 v87.58,58.63 | U$15.10 79.45,66.86 79.78,66.53 v83.28,66.53 | U$15.17 83.31,67.56 v83.28,67.53 | v83.28,64.53 78.78,60.03 78.78,59.03 79.25,58.56 U$15.3 | v80.4,71.3 77.8,71.3 76.5,70 76.5,53.5 75.5,52.5 75.5,18.25 71.5,14.25 U$27.2
SCL16  (via drill 0.35)
  Top 0.203: v91.18,77.23 89.48,77.23 88.88,76.63 v87.58,76.63 83.28,80.93 v83.28,82.53 v83.28,84.53 v83.28,85.53 83.28,87.54 82.79,88.03 U$16.31 80.82,89.72 v80.4,89.3
  Bottom 0.203: U$16.26 91.06,77.21 v91.18,77.23 | U$16.24 87.65,76.56 v87.58,76.63 | U$16.10 79.45,84.86 79.78,84.53 v83.28,84.53 | U$16.17 83.31,85.56 v83.28,85.53 | v83.28,82.53 78.78,78.03 78.78,77.03 79.25,76.56 U$16.3 | v80.4,89.3 77.8,89.3 76.5,88 76.5,71 75.5,70 75.5,53.5 74.5,52.5 74.5,18.25 71.2,14.95 U$27.1
SCL17  (via drill 0.35)
  Top 0.203: v109.18,23.23 107.48,23.23 106.88,22.63 v105.58,22.63 101.28,26.93 v101.28,28.53 v101.28,30.53 v101.28,31.53 101.28,33.54 100.79,34.03 U$17.31 98.72,35.72 v97,34
  Bottom 0.203: U$17.26 109.06,23.21 v109.18,23.23 | U$17.24 105.65,22.56 v105.58,22.63 | U$17.10 97.45,30.86 97.78,30.53 v101.28,30.53 | U$17.17 101.31,31.56 v101.28,31.53 | v101.28,28.53 96.78,24.03 96.78,23.03 97.25,22.56 U$17.3 | v97,34 95.5,32.5 95.5,24.03 90.75,19.28 84,19.28 82.78,19.28 82.53,19.28 74.5,11.25 U$27.8
SCL18  (via drill 0.35)
  Top 0.203: v109.18,41.23 107.48,41.23 106.88,40.63 v105.58,40.63 101.28,44.93 v101.28,46.53 v101.28,48.53 v101.28,49.53 101.28,51.54 100.79,52.03 U$18.31 98.82,53.72 v98.4,53.3
  Bottom 0.203: U$18.26 109.06,41.21 v109.18,41.23 | U$18.24 105.65,40.56 v105.58,40.63 | U$18.10 97.45,48.86 97.78,48.53 v101.28,48.53 | U$18.17 101.31,49.56 v101.28,49.53 | v101.28,46.53 96.78,42.03 96.78,41.03 97.25,40.56 U$18.3 | v98.4,53.3 95.3,53.3 94.5,52.5 94.5,23.6 90.59,19.69 81.94,19.69 74,11.75 U$27.7
SCL19  (via drill 0.35)
  Top 0.203: v109.18,59.23 107.48,59.23 106.88,58.63 v105.58,58.63 101.28,62.93 v101.28,64.53 v101.28,66.53 v101.28,67.53 101.28,69.54 100.79,70.03 U$19.31 98.82,71.72 v98.4,71.3
  Bottom 0.203: U$19.26 109.06,59.21 v109.18,59.23 | U$19.24 105.65,58.56 v105.58,58.63 | U$19.10 97.45,66.86 97.78,66.53 v101.28,66.53 | U$19.17 101.31,67.56 v101.28,67.53 | v101.28,64.53 96.78,60.03 96.78,59.03 97.25,58.56 U$19.3 | v98.4,71.3 95.8,71.3 94.5,70 94.5,53.5 93.5,52.5 93.5,23.18 90.42,20.09 81.34,20.09 73.5,12.25 U$27.6
SCL20  (via drill 0.35)
  Top 0.203: v109.18,77.23 107.48,77.23 106.88,76.63 v105.58,76.63 101.28,80.93 v101.28,82.53 v101.28,84.53 v101.28,85.53 101.28,87.54 100.79,88.03 U$20.31 98.82,89.72 v98.4,89.3
  Bottom 0.203: U$20.26 109.06,77.21 v109.18,77.23 | U$20.24 105.65,76.56 v105.58,76.63 | U$20.10 97.45,84.86 97.78,84.53 v101.28,84.53 | U$20.17 101.31,85.56 v101.28,85.53 | v101.28,82.53 96.78,78.03 96.78,77.03 97.25,76.56 U$20.3 | v98.4,89.3 95.8,89.3 94.5,88 94.5,71 93.5,70 93.5,53.5 92.5,52.5 92.5,22.75 90.25,20.5 80.75,20.5 73,12.75 U$27.5
SCL21  (via drill 0.35)
  Top 0.203: v127.18,23.23 125.48,23.23 124.88,22.63 v123.58,22.63 119.28,26.93 v119.28,28.53 v119.28,30.53 v119.28,31.53 119.28,33.54 118.79,34.03 U$21.31 116.72,35.72 v115,34
  Bottom 0.203: U$21.26 127.06,23.21 v127.18,23.23 | U$21.24 123.65,22.56 v123.58,22.63 | U$21.10 115.45,30.86 115.78,30.53 v119.28,30.53 | U$21.17 119.31,31.56 v119.28,31.53 | v119.28,28.53 114.78,24.03 114.78,23.03 115.25,22.56 U$21.3 | v115,34 113.5,32.5 113.5,24.5 106.66,17.66 85.5,17.66 85.16,17.66 84.91,17.66 76.5,9.25 U$27.12
SCL22  (via drill 0.35)
  Top 0.203: v126.43,39.73 125.73,39.73 124.88,40.63 v123.58,40.63 119.28,44.93 v119.28,46.53 v119.28,48.53 v119.28,49.53 119.28,51.54 118.79,52.03 U$22.31 116.82,53.72 v116.4,53.3
  Bottom 0.203: U$22.24 123.65,40.56 v123.58,40.63 | U$22.10 115.45,48.86 115.78,48.53 v119.28,48.53 | U$22.17 119.31,49.56 v119.28,49.53 | v119.28,46.53 114.78,42.03 114.78,41.03 115.25,40.56 U$22.3 | v116.4,53.3 113.3,53.3 112.5,52.5 112.5,24.1 106.46,18.06 85,18.06 84.56,18.06 84.31,18.06 76,9.75 U$27.11 | U$22.26 126.54,41.21 127,40.75 127,40.3 v126.43,39.73
SCL23  (via drill 0.35)
  Top 0.203: v126.43,57.73 125.73,57.73 124.88,58.63 v123.58,58.63 119.28,62.93 v119.28,64.53 v119.28,66.53 v119.28,67.53 119.28,69.54 118.79,70.03 U$23.31 116.82,71.72 v116.4,71.3
  Bottom 0.203: U$23.24 123.65,58.56 v123.58,58.63 | U$23.10 115.45,66.86 115.78,66.53 v119.28,66.53 | U$23.17 119.31,67.56 v119.28,67.53 | v119.28,64.53 114.78,60.03 114.78,59.03 115.25,58.56 U$23.3 | v116.4,71.3 113.8,71.3 112.5,70 112.5,53.5 111.5,52.5 111.5,23.68 106.29,18.47 84.25,18.47 83.97,18.47 83.72,18.47 75.5,10.25 U$27.10 | U$23.26 126.48,59.21 126.97,58.72 126.97,58.27 v126.43,57.73
SCL24  (via drill 0.35)
  Top 0.203: v126.43,75.73 125.73,75.73 124.88,76.63 v123.58,76.63 119.28,80.93 v119.28,82.53 v119.28,84.53 v119.28,85.53 119.28,87.54 118.79,88.03 U$24.31 116.82,89.72 v116.4,89.3
  Bottom 0.203: v126.43,75.73 126.31,75.71 126.88,76.28 126.88,76.87 126.54,77.21 U$24.26 | U$24.24 123.65,76.56 v123.58,76.63 | U$24.10 115.45,84.86 115.78,84.53 v119.28,84.53 | U$24.17 119.31,85.56 v119.28,85.53 | v119.28,82.53 114.78,78.03 114.78,77.03 115.25,76.56 U$24.3 | v116.4,89.3 113.8,89.3 112.5,88 112.5,71 111.5,70 111.5,53.5 110.5,52.5 110.5,23.25 106.12,18.87 84,18.87 83.37,18.87 83.12,18.87 75,10.75 U$27.9
SCLK
  Bottom 0.203: U$27.43 67.25,15.25 67.5,15 70,15 70,9 70.24,8.76 77.01,8.76 84.75,16.5 136.5,16.5 145.16,25.16 145.16,32.76 146.02,33.61 R1.1 146.02,39.19 JP1.11
SDA1  (via drill 0.35)
  Top 0.203: v33.58,32.83 34.98,32.83 35.58,32.23 v37.18,32.23 | v33.58,23.93 30.28,27.23 v30.28,28.53 v30.28,29.53 30.28,33.53 30.89,34.14 v30.89,34.53 U$1.33 30,34.83 v30,34.53 | v26,34 24,32 24,22 35.25,10.75 U$26.9
  Bottom 0.203: U$1.19 36.76,32.21 v37.18,32.23 | U$1.15 33.61,32.86 v33.58,32.83 33.58,34.23 33.28,34.53 v30.89,34.53 | U$1.1 25.61,23.86 v30.28,28.53 | U$1.22 33.65,23.86 v33.58,23.93 | v30.28,29.53 26.2,29.53 24.92,30.82 24.92,32.45 25.33,32.86 U$1.8 | v26,34 26.53,34.53 v30,34.53
SDA2  (via drill 0.35)
  Top 0.203: v33.58,50.83 34.98,50.83 35.58,50.23 v37.18,50.23 | v33.58,41.93 30.28,45.23 v30.28,46.53 v30.28,47.53 30.28,51.53 30.89,52.14 v30.89,52.53 U$2.33 30,52.83 v30,52.53 | v23.67,52.53 23.53,52.53 23,52 23,22 34.5,10.5 34.75,10.25 U$26.10
  Bottom 0.203: U$2.19 36.76,50.21 v37.18,50.23 | U$2.15 33.61,50.86 v33.58,50.83 33.58,52.23 33.28,52.53 v30.89,52.53 | U$2.1 25.61,41.86 v30.28,46.53 | U$2.22 33.65,41.86 v33.58,41.93 | v30.28,47.53 26.2,47.53 24.92,48.81 24.92,50.45 25.33,50.86 U$2.8 | v23.67,52.53 v30,52.53
SDA3  (via drill 0.35)
  Top 0.203: v33.58,68.83 34.98,68.83 35.58,68.23 v37.18,68.23 | v33.58,59.93 30.28,63.23 v30.28,64.53 v30.28,65.53 30.28,69.53 30.89,70.14 v30.89,70.53 U$3.33 30,70.83 v30,70.53 | v23.5,70 23.5,54 22,52.5 22,22 34.25,9.75 U$26.11
  Bottom 0.203: U$3.19 36.76,68.21 v37.18,68.23 | U$3.15 33.61,68.86 v33.58,68.83 33.58,70.23 33.28,70.53 v30.89,70.53 | U$3.1 25.61,59.86 v30.28,64.53 | U$3.22 33.65,59.86 v33.58,59.93 | v30.28,65.53 26.2,65.53 24.92,66.81 24.92,68.45 25.33,68.86 U$3.8 | v23.5,70 24.03,70.53 v30,70.53
SDA4  (via drill 0.35)
  Top 0.203: v33.58,86.83 34.98,86.83 35.58,86.23 v37.18,86.23 | v33.58,77.93 30.28,81.23 v30.28,82.53 v30.28,83.53 30.28,87.53 30.89,88.14 v30.89,88.53 U$4.33 30,88.83 v30,88.53 | v23.5,88 23.5,71.5 22,70 22,53.5 21,52.5 21,22 33.5,9.5 33.75,9.25 U$26.12
  Bottom 0.203: U$4.19 36.76,86.21 v37.18,86.23 | U$4.15 33.61,86.86 v33.58,86.83 33.58,88.23 33.28,88.53 v30.89,88.53 | U$4.1 25.61,77.86 v30.28,82.53 | U$4.22 33.65,77.86 v33.58,77.93 | v30.28,83.53 26.2,83.53 24.92,84.81 24.92,86.45 25.33,86.86 U$4.8 | v23.5,88 24.03,88.53 v30,88.53
SDA5  (via drill 0.35)
  Top 0.203: v51.58,32.83 52.98,32.83 53.58,32.23 v55.18,32.23 | v51.58,23.93 48.28,27.23 v48.28,28.53 v48.28,29.53 48.28,33.53 48.89,34.14 v48.89,34.53 U$5.33 48.01,34.84 v48.01,34.53 | v44,34 42,32 42,23.07 35.5,16.57 35.5,13.25 36,12.75 U$26.5
  Bottom 0.203: U$5.19 54.76,32.21 v55.18,32.23 | U$5.15 51.61,32.86 v51.58,32.83 51.58,34.23 51.28,34.53 v48.89,34.53 | U$5.1 43.61,23.86 v48.28,28.53 | U$5.22 51.65,23.86 v51.58,23.93 | v48.28,29.53 44.2,29.53 42.92,30.82 42.92,32.45 43.33,32.86 U$5.8 | v44,34 44.53,34.53 v48.01,34.53
SDA6  (via drill 0.35)
  Top 0.203: v51.58,50.83 52.98,50.83 53.58,50.23 v55.18,50.23 | v51.58,41.93 48.28,45.23 v48.28,46.53 v48.28,47.53 48.28,51.53 48.89,52.14 v48.89,52.53 U$6.33 48,52.83 v48,52.53 | v41.67,52.53 41.53,52.53 41,52 41,22.65 35,16.65 35,13 35.75,12.25 U$26.6
  Bottom 0.203: U$6.19 54.76,50.21 v55.18,50.23 | U$6.15 51.61,50.86 v51.58,50.83 51.58,52.23 51.28,52.53 v48.89,52.53 | U$6.1 43.61,41.86 v48.28,46.53 | U$6.22 51.65,41.86 v51.58,41.93 | v48.28,47.53 44.2,47.53 42.92,48.81 42.92,50.45 43.33,50.86 U$6.8 | v48,52.53 v41.67,52.53
SDA7  (via drill 0.35)
  Top 0.203: v51.58,68.83 52.98,68.83 53.58,68.23 v55.18,68.23 | v51.58,59.93 48.28,63.23 v48.28,64.53 v48.28,65.53 48.28,69.53 48.89,70.14 v48.89,70.53 U$7.33 48.89,71.39 v48,70.5 | v41.5,70 41.5,54 40,52.5 40,22.22 34.76,16.99 34.64,16.86 34.5,16.72 34.5,15.25 34.5,12.75 35.5,11.75 U$26.7
  Bottom 0.203: U$7.19 54.76,68.21 v55.18,68.23 | U$7.15 51.61,68.86 v51.58,68.83 51.58,70.23 51.28,70.53 v48.89,70.53 | U$7.1 43.61,59.86 v48.28,64.53 | U$7.22 51.65,59.86 v51.58,59.93 | v48.28,65.53 44.2,65.53 42.92,66.81 42.92,68.45 43.33,68.86 U$7.8 | v48,70.5 42,70.5 v41.5,70
SDA8  (via drill 0.35)
  Top 0.203: v51.58,86.83 52.98,86.83 53.58,86.23 v55.18,86.23 | v51.58,77.93 48.28,81.23 v48.28,82.53 v48.28,83.53 48.28,87.53 48.89,88.14 v48.89,88.53 U$8.33 48,88.83 v48,88.53 | v41.5,88 41.5,71.5 40,70 40,53.5 39,52.5 39,21.8 34,16.8 34,12.54 35.29,11.25 U$26.8
  Bottom 0.203: U$8.19 54.76,86.21 v55.18,86.23 | U$8.15 51.61,86.86 v51.58,86.83 51.58,88.23 51.28,88.53 v48.89,88.53 | U$8.1 43.61,77.86 v48.28,82.53 | U$8.22 51.65,77.86 v51.58,77.93 | v48.28,83.53 44.2,83.53 42.92,84.81 42.92,86.45 43.33,86.86 U$8.8 | v41.5,88 42.03,88.53 v48,88.53
SDA9  (via drill 0.35)
  Top 0.203: v69.58,32.83 70.98,32.83 71.58,32.23 v73.18,32.23 | v69.58,23.93 66.28,27.23 v66.28,28.53 v66.28,29.53 66.28,33.53 66.89,34.14 v66.89,34.53 U$9.33 66.01,34.84 v66.01,34.53 | v62,34 60,32 60,24 56.75,20.75 42.5,20.75 42.25,20.75 42,20.75 41.98,20.73 41.5,20.25 37.5,16.25 37.5,15.05 U$26.1
  Bottom 0.203: U$9.19 72.76,32.21 v73.18,32.23 | U$9.15 69.61,32.86 v69.58,32.83 69.58,34.23 69.28,34.53 v66.89,34.53 | U$9.1 61.61,23.86 v66.28,28.53 | U$9.22 69.65,23.86 v69.58,23.93 | v66.28,29.53 62.2,29.53 60.92,30.82 60.92,32.45 61.33,32.86 U$9.8 | v66.01,34.53 62.53,34.53 v62,34
SDA10  (via drill 0.35)
  Top 0.203: v69.58,50.83 70.98,50.83 71.58,50.23 v73.18,50.23 | v69.58,41.93 66.28,45.23 v66.28,46.53 v66.28,47.53 66.28,51.53 66.89,52.14 v66.89,52.53 U$10.33 66,52.83 v66,52.53 | v59.67,52.53 59.53,52.53 59,52 59,24 56.16,21.16 41.81,21.16 37.08,16.43 37.02,16.37 37,16.35 37,14.25 U$26.2
  Bottom 0.203: U$10.19 72.76,50.21 v73.18,50.23 | U$10.15 69.61,50.86 v69.58,50.83 69.58,52.23 69.28,52.53 v66.89,52.53 | U$10.1 61.61,41.86 v66.28,46.53 | U$10.22 69.65,41.86 v69.58,41.93 | v66.28,47.53 62.2,47.53 60.92,48.81 60.92,50.45 61.33,50.86 U$10.8 | v66,52.53 v59.67,52.53
SDA11  (via drill 0.35)
  Top 0.203: v69.58,68.83 70.98,68.83 71.58,68.23 v73.18,68.23 | v69.58,59.93 66.28,63.23 v66.28,64.53 v66.28,65.53 66.28,69.53 66.89,70.14 v66.89,70.53 U$11.33 66,70.83 v66,70.53 | v59.5,70 59.5,54 58,52.5 58,24 55.57,21.57 41.64,21.57 36.5,16.43 36.5,13.75 U$26.3
  Bottom 0.203: U$11.19 72.76,68.21 v73.18,68.23 | U$11.15 69.61,68.86 v69.58,68.83 69.58,70.23 69.28,70.53 v66.89,70.53 | U$11.1 61.61,59.86 v66.28,64.53 | U$11.22 69.65,59.86 v69.58,59.93 | v66.28,65.53 62.2,65.53 60.92,66.81 60.92,68.45 61.33,68.86 U$11.8 | v66,70.53 60.03,70.53 v59.5,70
SDA12  (via drill 0.35)
  Top 0.203: v69.58,86.83 70.98,86.83 71.58,86.23 v73.18,86.23 | v69.58,77.93 66.28,81.23 v66.28,82.53 v66.28,83.53 66.28,87.53 66.89,88.14 v66.89,88.53 U$12.33 66,88.83 v66,88.53 | v59.5,88 59.5,71.5 58,70 58,53.5 57,52.5 57,24 55,22 51.88,22 51.85,21.97 41.47,21.97 36,16.5 36,13.5 36.25,13.25 U$26.4
  Bottom 0.203: U$12.19 72.76,86.21 v73.18,86.23 | U$12.15 69.61,86.86 v69.58,86.83 69.58,88.23 69.28,88.53 v66.89,88.53 | U$12.1 61.61,77.86 v66.28,82.53 | U$12.22 69.65,77.86 v69.58,77.93 | v66.28,83.53 62.2,83.53 60.92,84.81 60.92,86.45 61.33,86.86 U$12.8 | v66,88.53 60.03,88.53 v59.5,88
SDA13  (via drill 0.35)
  Top 0.203: v87.58,32.83 88.98,32.83 89.58,32.23 v91.18,32.23 | v87.58,23.93 84.28,27.23 v84.28,28.53 v84.28,29.53 84.28,33.53 84.89,34.14 v84.89,34.53 U$13.33 84,34.83 v84,34.53 | v80,34 78,32 78,24 74.28,20.28 58.58,20.28 57.77,19.48 57.43,19.13 51.55,13.25 U$26.33
  Bottom 0.203: U$13.19 90.76,32.21 v91.18,32.23 | U$13.15 87.61,32.86 v87.58,32.83 87.58,34.23 87.28,34.53 v84.89,34.53 | U$13.1 79.61,23.86 v84.28,28.53 | U$13.22 87.65,23.86 v87.58,23.93 | v84.28,29.53 80.2,29.53 78.92,30.82 78.92,32.45 79.33,32.86 U$13.8 | v84,34.53 80.53,34.53 v80,34
SDA14  (via drill 0.35)
  Top 0.203: v87.58,50.83 88.98,50.83 89.58,50.23 v91.18,50.23 | v87.58,41.93 84.28,45.23 v84.28,46.53 v84.28,47.53 84.28,51.53 84.89,52.14 v84.89,52.53 U$14.33 84,52.83 v84,52.53 | v77.67,52.53 77.53,52.53 77,52 77,24 73.69,20.69 58.41,20.69 51.47,13.75 U$26.34
  Bottom 0.203: U$14.19 90.76,50.21 v91.18,50.23 | U$14.15 87.61,50.86 v87.58,50.83 87.58,52.23 87.28,52.53 v84.89,52.53 | U$14.1 79.61,41.86 v84.28,46.53 | U$14.22 87.65,41.86 v87.58,41.93 | v84.28,47.53 80.2,47.53 78.92,48.81 78.92,50.45 79.33,50.86 U$14.8 | v84,52.53 v77.67,52.53
SDA15  (via drill 0.35)
  Top 0.203: v87.58,68.83 88.98,68.83 89.58,68.23 v91.18,68.23 | v87.58,59.93 84.28,63.23 v84.28,64.53 v84.28,65.53 84.28,69.53 84.89,70.14 v84.89,70.53 U$15.33 84,70.83 v84,70.53 | v77.5,70 77.5,54 76,52.5 76,24 73.09,21.09 58.24,21.09 57.33,20.18 57.09,19.94 51.4,14.25 U$26.35
  Bottom 0.203: U$15.19 90.76,68.21 v91.18,68.23 | U$15.15 87.61,68.86 v87.58,68.83 87.58,70.23 87.28,70.53 v84.89,70.53 | U$15.1 79.61,59.86 v84.28,64.53 | U$15.22 87.65,59.86 v87.58,59.93 | v84.28,65.53 80.2,65.53 78.92,66.81 78.92,68.45 79.33,68.86 U$15.8 | v84,70.53 78.03,70.53 v77.5,70
SDA16  (via drill 0.35)
  Top 0.203: v87.58,86.83 88.98,86.83 89.58,86.23 v91.18,86.23 | v87.58,77.93 84.28,81.23 v84.28,82.53 v84.28,83.53 84.28,87.53 84.89,88.14 v84.89,88.53 U$16.33 84,88.83 v84,88.53 | v77.5,88 77.5,71.5 76,70 76,53.5 75,52.5 75,24 72.5,21.5 58.08,21.5 57.04,20.46 56.92,20.35 51.33,14.75 U$26.36
  Bottom 0.203: U$16.19 90.76,86.21 v91.18,86.23 | U$16.15 87.61,86.86 v87.58,86.83 87.58,88.23 87.28,88.53 v84.89,88.53 | U$16.1 79.61,77.86 v84.28,82.53 | U$16.22 87.65,77.86 v87.58,77.93 | v84.28,83.53 80.2,83.53 78.92,84.81 78.92,86.45 79.33,86.86 U$16.8 | v84,88.53 78.03,88.53 v77.5,88
SDA17  (via drill 0.35)
  Top 0.203: v105.58,32.83 106.98,32.83 107.58,32.23 v109.18,32.23 | v105.58,23.93 102.28,27.23 v102.28,28.53 v102.28,29.53 102.28,33.53 102.89,34.14 v102.89,34.53 U$17.33 102,34.83 v102,34.53 | v98,34 96,32 96,23.5 92.25,19.75 91.16,18.66 59.25,18.66 51.85,11.25 U$26.29
  Bottom 0.203: U$17.19 108.76,32.21 v109.18,32.23 | U$17.15 105.61,32.86 v105.58,32.83 105.58,34.23 105.28,34.53 v102.89,34.53 | U$17.1 97.61,23.86 v102.28,28.53 | U$17.22 105.65,23.86 v105.58,23.93 | v102.28,29.53 98.2,29.53 96.92,30.82 96.92,32.45 97.33,32.86 U$17.8 | v102,34.53 98.53,34.53 v98,34
SDA18  (via drill 0.35)
  Top 0.152: v95.67,52.53 95.67,49.33 96,49
  Top 0.203: v105.58,50.83 106.98,50.83 107.58,50.23 v109.18,50.23 | v105.58,41.93 102.28,45.23 v102.28,46.53 v102.28,47.53 102.28,51.53 102.89,52.14 v102.89,52.53 U$18.33 102,52.83 v102,52.53 | v95.67,52.53 95.53,52.53 95,52 95,23.5 90.56,19.06 59.09,19.06 58.01,17.99 57.93,17.91 51.77,11.75 U$26.30
  Bottom 0.203: U$18.19 108.76,50.21 v109.18,50.23 | U$18.15 105.61,50.86 v105.58,50.83 105.58,52.23 105.28,52.53 v102.89,52.53 | U$18.1 97.61,41.86 v102.28,46.53 | U$18.22 105.65,41.86 v105.58,41.93 | v102.28,47.53 98.2,47.53 96.92,48.81 96.92,50.45 97.33,50.86 U$18.8 | v102,52.53 v95.67,52.53
SDA19  (via drill 0.35)
  Top 0.203: v105.58,68.83 106.98,68.83 107.58,68.23 v109.18,68.23 | v105.58,59.93 102.28,63.23 v102.28,64.53 v102.28,65.53 102.28,69.53 102.89,70.14 v102.89,70.53 U$19.33 102.89,71.39 v102,70.5 | v95.5,70 95.5,54 94,52.5 94,23.5 89.97,19.47 58.92,19.47 57.97,18.53 57.76,18.32 51.7,12.25 U$26.31
  Bottom 0.203: U$19.19 108.76,68.21 v109.18,68.23 | U$19.15 105.61,68.86 v105.58,68.83 105.58,70.23 105.28,70.53 v102.89,70.53 | U$19.1 97.61,59.86 v102.28,64.53 | U$19.22 105.65,59.86 v105.58,59.93 | v102.28,65.53 98.2,65.53 96.92,66.81 96.92,68.45 97.33,68.86 U$19.8 | v102,70.5 96,70.5 v95.5,70
SDA20  (via drill 0.35)
  Top 0.203: v105.58,86.83 106.98,86.83 107.58,86.23 v109.18,86.23 | v105.58,77.93 102.28,81.23 v102.28,82.53 v102.28,83.53 102.28,87.53 102.89,88.14 v102.89,88.53 U$20.33 102,88.83 v102,88.53 | v95.5,88 95.5,71.5 94,70 94,53.5 93,52.5 93,23.5 89.37,19.87 58.75,19.87 57.69,18.81 57.59,18.72 51.62,12.75 U$26.32
  Bottom 0.203: U$20.19 108.76,86.21 v109.18,86.23 | U$20.15 105.61,86.86 v105.58,86.83 105.58,88.23 105.28,88.53 v102.89,88.53 | U$20.1 97.61,77.86 v102.28,82.53 | U$20.22 105.65,77.86 v105.58,77.93 | v102.28,83.53 98.2,83.53 96.92,84.81 96.92,86.45 97.33,86.86 U$20.8 | v102,88.53 96.03,88.53 v95.5,88
SDA21  (via drill 0.35)
  Top 0.203: v123.58,32.83 124.98,32.83 125.58,32.23 v127.18,32.23 | v123.58,23.93 120.28,27.23 v120.28,28.53 v120.28,29.53 120.28,33.53 120.89,34.14 v120.89,34.53 U$21.33 120,34.83 v120,34.53 | v116,34 114,32 114,23 111,20 108.13,17.13 108.03,17.03 84.64,17.03 84.5,17.03 59.93,17.03 52.15,9.25 U$26.25
  Bottom 0.203: U$21.19 126.76,32.21 v127.18,32.23 | U$21.15 123.61,32.86 v123.58,32.83 123.58,34.23 123.28,34.53 v120.89,34.53 | U$21.1 115.61,23.86 v120.28,28.53 | U$21.22 123.65,23.86 v123.58,23.93 | v120.28,29.53 116.2,29.53 114.92,30.82 114.92,32.45 115.33,32.86 U$21.8 | v116,34 116.53,34.53 v120,34.53
SDA22  (via drill 0.35)
  Top 0.203: v123.58,50.83 124.98,50.83 125.47,50.35 v127.18,50.35 | v123.58,41.93 120.28,45.23 v120.28,46.53 v120.28,47.53 120.28,51.53 120.89,52.14 v120.89,52.53 U$22.33 120,52.83 v120,52.53 | v113.67,52.53 113.53,52.53 113,52 113,23 109,19 107.51,17.51 107.44,17.44 59.76,17.44 52.07,9.75 U$26.26
  Bottom 0.203: U$22.19 126.96,50.21 v127.18,50.35 | U$22.15 123.61,50.86 v123.58,50.83 123.58,52.23 123.28,52.53 v120.89,52.53 | U$22.1 115.61,41.86 v120.28,46.53 | U$22.22 123.65,41.86 v123.58,41.93 | v120.28,47.53 116.2,47.53 114.92,48.81 114.92,50.45 115.33,50.86 U$22.8 | v120,52.53 v113.67,52.53
SDA23  (via drill 0.35)
  Top 0.203: v123.58,59.93 120.28,63.23 v120.28,64.53 v120.28,65.53 120.28,69.53 120.89,70.14 v120.89,70.53 U$23.33 120,70.83 v120,70.53 | v113.5,70 113.5,54 112,52.5 112,23 108.75,19.75 106.89,17.89 106.84,17.84 59.59,17.84 52,10.25 U$26.27 | v123.58,68.83 123.96,68.83 v126.16,66.63
  Bottom 0.203: U$23.15 123.61,68.86 v123.58,68.83 123.58,70.23 123.28,70.53 v120.89,70.53 | U$23.1 115.61,59.86 v120.28,64.53 | U$23.22 123.65,59.86 v123.58,59.93 | v120.28,65.53 116.2,65.53 114.92,66.81 114.92,68.45 115.33,68.86 U$23.8 | v120,70.53 114.03,70.53 v113.5,70 | U$23.19 126.57,68.21 126.91,67.87 126.91,67.38 v126.16,66.63
SDA24  (via drill 0.35)
  Top 0.203: v123.58,86.83 124.98,86.83 125.58,86.23 v127.18,86.23 | v123.58,77.93 120.28,81.23 v120.28,82.53 v120.28,83.53 120.28,87.53 120.89,88.14 v120.89,88.53 U$24.33 120,88.83 v120,88.53 | v113.5,88 113.5,71.5 112,70 112,53.5 111,52.5 111,23 107.5,19.5 106.28,18.27 106.25,18.25 84.24,18.25 84,18.25 59.42,18.25 51.92,10.75 U$26.28
  Bottom 0.203: U$24.19 126.76,86.21 v127.18,86.23 | U$24.15 123.61,86.86 v123.58,86.83 123.58,88.23 123.28,88.53 v120.89,88.53 | U$24.1 115.61,77.86 v120.28,82.53 | U$24.22 123.65,77.86 v123.58,77.93 | v120.28,83.53 116.2,83.53 114.92,84.81 114.92,86.45 115.33,86.86 U$24.8 | v120,88.53 114.03,88.53 v113.5,88
SDAT  (via drill 0.35)
  Top 0.203: U$26.43 41.75,15.25 42,15 45,15 45,9 45.5,8.5 63.25,8.5 64.25,9.5 115.5,9.5 v119,13
  Bottom 0.203: v119,13 122.09,16.09 125.48,16.09 125.62,16.12 136.66,16.12 146.02,25.48 R2.1 148.32,34.3 JP1.12
VDD  (via drill 0.35)
  Top 0.203: v32.28,28.53 v32.28,33.53 32.78,33.53 v34.28,35.03 34.28,37.03 33.55,37.76 U$1.29 U$1.34 U$1.32 28.33,37.3 27.4,37.3 25.4,39.3 25.4,56.3 | v32.28,82.53 v32.28,87.53 32.78,87.53 v34.28,89.03 34.28,91.03 33.55,91.76 U$4.29 U$4.34 U$4.32 27.94,91.76 27.4,92.3 25.4,92.3 | v32.28,64.53 v32.28,69.53 32.78,69.53 v34.28,71.03 34.28,73.03 33.55,73.76 U$3.29 U$3.34 U$3.32 27.94,73.76 27.4,74.3 25.4,74.3 | v32.28,46.53 v32.28,51.53 32.78,51.53 v34.28,53.03 34.28,55.03 33.55,55.76 U$2.29 U$2.34 U$2.32 27.94,55.76 27.4,56.3 25.4,56.3 | 25.4,74.3 25.4,56.3 | 25.4,92.3 25.4,74.3 | 25.4,92.3 25.4,92.8 26.1,93.5 | v50.28,28.53 v50.28,33.53 50.78,33.53 v52.28,35.03 52.28,37.03 51.55,37.76 U$5.29 U$5.34 U$5.32 46.33,37.3 45.4,37.3 43.4,39.3 43.4,56.3 | v50.28,82.53 v50.28,87.53 50.78,87.53 v52.28,89.03 52.28,91.03 51.55,91.76 U$8.29 U$8.34 U$8.32 45.94,91.76 45.4,92.3 43.4,92.3 | v50.28,64.53 v50.28,69.53 50.78,69.53 v52.28,71.03 52.28,73.03 51.55,73.76 U$7.29 U$7.34 U$7.32 45.94,73.76 45.4,74.3 43.4,74.3 | v50.28,46.53 v50.28,51.53 50.78,51.53 v52.28,53.03 52.28,55.03 51.55,55.76 U$6.29 U$6.34 U$6.32 45.94,55.76 45.4,56.3 43.4,56.3 | 43.4,74.3 43.4,56.3 | 43.4,74.3 43.4,92.3 | v68.28,28.53 v68.28,33.53 68.78,33.53 v70.28,35.03 70.28,37.03 69.55,37.76 U$9.29 U$9.34 U$9.32 64.33,37.3 63.4,37.3 61.4,39.3 61.4,56.3 | v68.28,82.53 v68.28,87.53 68.78,87.53 v70.28,89.03 70.28,91.03 69.55,91.76 U$12.29 U$12.34 U$12.32 63.94,91.76 63.4,92.3 61.4,92.3 | v68.28,64.53 v68.28,69.53 68.78,69.53 v70.28,71.03 70.28,73.03 69.55,73.76 U$11.29 U$11.34 U$11.32 63.94,73.76 63.4,74.3 61.4,74.3